# Altium schematic sheet Motor controllers.SchDoc: Motor Controllers
size 431 x 279 mm; ApprovedBy: John Watson; DrawnBy: Medhi; DocumentNumber: BMC-125-5321; Revision: A; SheetNumber: 3; SheetTotal: 6
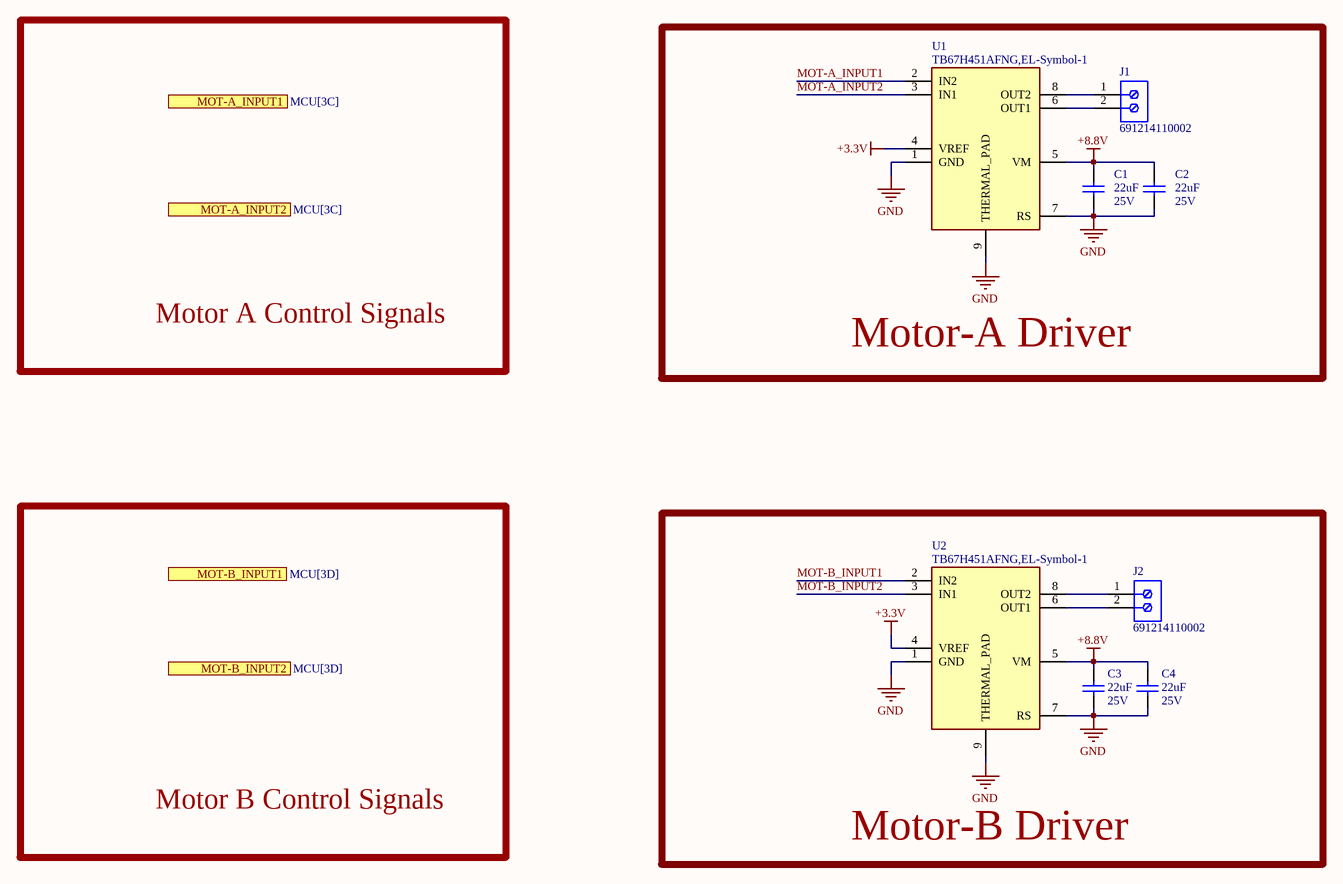
[diagram p0: Motor controllers.SchDoc]

## Parts
C1  value 22uF  Rated DC Voltage (URdc): 25V  [CAPC320160X160_CL31H-0_2_M]  (hidden comment: 22uF 25V 1206)
C2  value 22uF  Rated DC Voltage (URdc): 25V  [CAPC320160X160_CL31H-0_2_M]  (hidden comment: 22uF 25V 1206)
C3  value 22uF  Rated DC Voltage (URdc): 25V  [CAPC320160X160_CL31H-0_2_M]  (hidden comment: 22uF 25V 1206)
C4  value 22uF  Rated DC Voltage (URdc): 25V  [CAPC320160X160_CL31H-0_2_M]  (hidden comment: 22uF 25V 1206)
J1  691214110002  [691214110002]
J2  691214110002  [691214110002]
U1  TB67H451AFNG,EL-Symbol-1  [SOIC127P600X170-9N]
U2  TB67H451AFNG,EL-Symbol-1  [SOIC127P600X170-9N]

## Blocks framed on the sheet
Motor-A Driver: C1 C2 J1 U1
Motor-B Driver: C3 C4 J2 U2

## Ports
MOT-A_INPUT1 (see MCU[3C]), MOT-A_INPUT2 (see MCU[3C]), MOT-B_INPUT1 (see MCU[3D]), MOT-B_INPUT2 (see MCU[3D])

## Nets
+3.3V: U1.4(VREF) U2.4(VREF)
+8.8V: C1.2 C2.2 C3.2 C4.2 U1.5(VM) U2.5(VM)
GND: C1.1 C2.1 C3.1 C4.1 U1.1(GND) U1.7(RS) U1.9(THERMAL_PAD) U2.1(GND) U2.7(RS) U2.9(THERMAL_PAD)
MOT-A_INPUT1: U1.2(IN2)
MOT-A_INPUT2: U1.3(IN1)
MOT-B_INPUT1: U2.2(IN2)
MOT-B_INPUT2: U2.3(IN1)
NetJ1_1: J1.1 U1.8(OUT2)
NetJ1_2: J1.2 U1.6(OUT1)
NetJ2_1: J2.1 U2.8(OUT2)
NetJ2_2: J2.2 U2.6(OUT1)

## Notes on the sheet
- Motor A Control Signals
- Motor B Control Signals
- 4
- 3
- DWG NO.
- REV
- 2
- 1
- ALL INFORMATION IN THIS DRAWING IS THE PROPERTY OF EMAC, AND CANNOT BE COPIED OR USED WITHOUT THE WRITTEN APPROVAL OF EMAC.
- D
- C
- B
- 2025 Bright Manufacturing Challenge
- SCHEMATIC
- A
- SIZE
- CODE IDENT
- 0BJZ8
- NONE
- SCALE
- WEIGHT
- NA
- SHEET
- OF
- REV. A, 06/21/2025
- FORM #PDE-0001-0001

## Library data of the parts
C1-C4 = CMP-00001-4: Ceramic Capacitor, Multilayer, Ceramic, 25V, 10% +Tol, 10% -Tol, X5R, 15% TC, 22uF, Surface Mount, 1206; Multilayer: Yes; Max Operating Temperature: 85°C; Min Operating Temperature: -55°C; Case/Package: 1206; Height: 1.8mm; Capacitor Type: Ceramic; Dielectric Material: Ceramic; JESD-609 Code: e3; Length: 3.2mm; Mounting Technology: Surface Mount; Package Shape: Rectangular; Package Style: SMTMeter; Packaging: Tape and Reel; Pins: 2; Reach SVHC Compliant: Yes; RoHS Compliant: Yes; Temperature Characteristics Code: X5R; Terminal Finish: Nickel; Termination: Wraparound; Tolerance  (fill in as +-): 10%; Tolerance (fill in as +-): 10%; Width: 1.6mm
J1 J2 = CMP-00011-1: Barrier Strip Terminal Block; Reach SVHC Compliant: No; RoHS Compliant: Yes; Terminal and Terminal Block Type: BARRIER STRIP TERMINAL BLOCK
U1 U2 = CMP-00027-3: PWM Chopper Type DC Brushed Motor Driver 24V 8-Pin HSOP; Type: Motor Driver